# Altium schematic sheet 4-20mA_Converter.SchDoc: Access Control
size A3; DrawnBy: Q.Thang & T.Khoa; Revision: V1.0.1; SheetNumber: 13; SheetTotal: 16
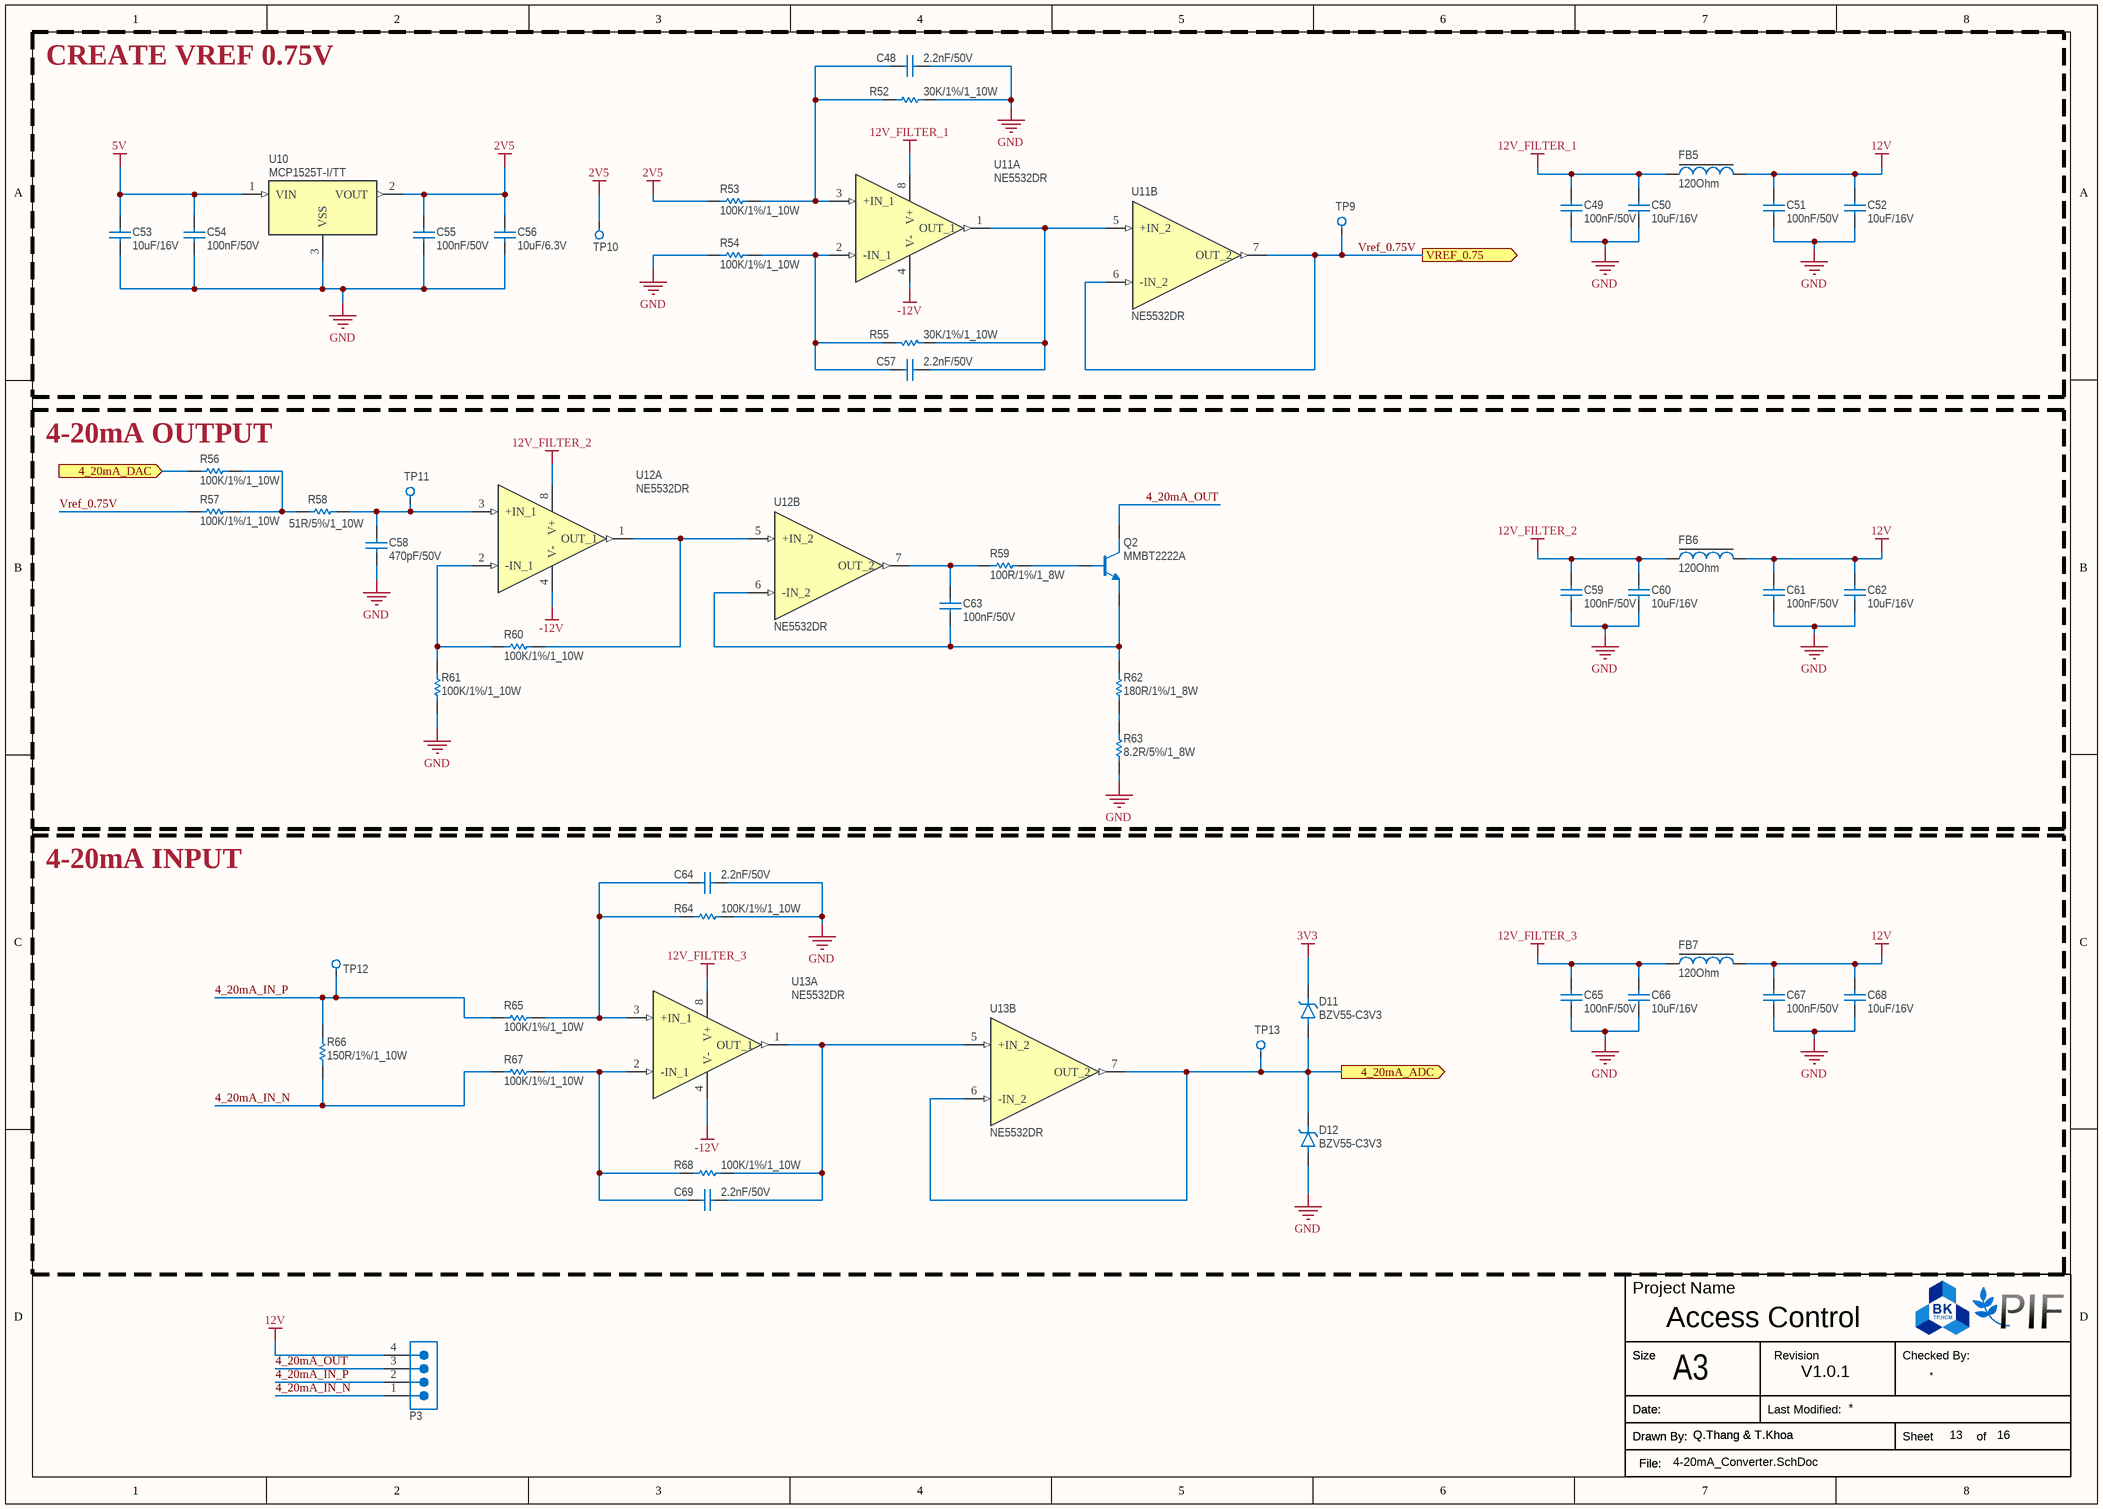
[diagram p0: 4-20mA_Converter.SchDoc]

## Parts
C48  2.2nF/50V  [CAP_0603]
C49  100nF/50V  [CAP_0603]
C50  10uF/16V  [CAP_0603]
C51  100nF/50V  [CAP_0603]
C52  10uF/16V  [CAP_0603]
C53  10uF/16V  [CAP_0603]
C54  100nF/50V  [CAP_0603]
C55  100nF/50V  [CAP_0603]
C56  10uF/6.3V  [CAP_0603]
C57  2.2nF/50V  [CAP_0603]
C58  470pF/50V  [CAP_0603]
C59  100nF/50V  [CAP_0603]
C60  10uF/16V  [CAP_0603]
C61  100nF/50V  [CAP_0603]
C62  10uF/16V  [CAP_0603]
C63  100nF/50V  [CAP_0603]
C64  2.2nF/50V  [CAP_0603]
C65  100nF/50V  [CAP_0603]
C66  10uF/16V  [CAP_0603]
C67  100nF/50V  [CAP_0603]
C68  10uF/16V  [CAP_0603]
C69  2.2nF/50V  [CAP_0603]
D11  BZV55-C3V3  [SOD-80]
D12  BZV55-C3V3  [SOD-80]
FB5  120Ohm  [Ferrite_Bead_0805]
FB6  120Ohm  [Ferrite_Bead_0805]
FB7  120Ohm  [Ferrite_Bead_0805]
P3  3.81mm_4P  [Terminal_Block_3.81mm_4P]  (value not drawn)
Q2  MMBT2222A  [SOT-23]
R52  30K/1%/1_10W  [Resistor_0603]
R53  100K/1%/1_10W  [Resistor_0603]
R54  100K/1%/1_10W  [Resistor_0603]
R55  30K/1%/1_10W  [Resistor_0603]
R56  100K/1%/1_10W  [Resistor_0603]
R57  100K/1%/1_10W  [Resistor_0603]
R58  51R/5%/1_10W  [Resistor_0603]
R59  100R/1%/1_8W  [Resistor_0603]
R60  100K/1%/1_10W  [Resistor_0603]
R61  100K/1%/1_10W  [Resistor_0603]
R62  180R/1%/1_8W  [Resistor_0805]
R63  8.2R/5%/1_8W  [Resistor_0805]
R64  100K/1%/1_10W  [Resistor_0603]
R65  100K/1%/1_10W  [Resistor_0603]
R66  150R/1%/1_10W  [Resistor_0603]
R67  100K/1%/1_10W  [Resistor_0603]
R68  100K/1%/1_10W  [Resistor_0603]
TP9  VREF_0.75V  [TestPoint_Pad_3.0x3.0mm]  (value not drawn)
TP10  2V5  [TestPoint_Pad_3.0x3.0mm]  (value not drawn)
TP11  4-20mA_DAC  [TestPoint_THTPad_D1.5mm_Drill0.7mm]  (value not drawn)
TP12  4_20mA_IN  [TestPoint_THTPad_D1.5mm_Drill0.7mm]  (value not drawn)
TP13  4-20mA_ADC  [TestPoint_THTPad_D1.5mm_Drill0.7mm]  (value not drawn)
U10  MCP1525T-I/TT  [SOT-23]
U11  NE5532DR  [SOIC-8]  (parts A,B of 2)
U12  NE5532DR  [SOIC-8]  (parts A,B of 2)
U13  NE5532DR  [SOIC-8]  (parts A,B of 2)

## Blocks framed on the sheet
CREATE VREF 0.75V: C48-C57 FB5 R52-R55 TP9 TP10 U10 U11
4-20mA OUTPUT: C58-C63 FB6 Q2 R56-R63 TP11 U12
4-20mA INPUT: C64-C69 D11 D12 FB7 R64-R68 TP12 TP13 U13

## Ports
4_20mA_ADC (out, see Overview_Schematic[6C], DAC_ADC_External[2B]), 4_20mA_DAC (in, see Overview_Schematic[6C], DAC_ADC_External[3C]), VREF_0.75 (out, see Overview_Schematic[6C], DAC_ADC_External[1B])

## Nets
2V5: C55.2 C56.2 R53.1 TP10.1 U10.2(VOUT)
3V3: D11.C
5V: C53.2 C54.2 U10.1(VIN)
12V: C51.2 C52.2 C61.2 C62.2 C67.2 C68.2 FB5.2 FB6.2 FB7.2 P3.4
12V_FILTER_1: C49.2 C50.2 FB5.1 U11.8(V+)
12V_FILTER_2: C59.2 C60.2 FB6.1 U12.8(V+)
12V_FILTER_3: C65.2 C66.2 FB7.1 U13.8(V+)
-12V: U11.4(V-) U12.4(V-) U13.4(V-)
GND: C48.2 C49.1 C50.1 C51.1 C52.1 C53.1 C54.1 C55.1 C56.1 C58.1 C59.1 C60.1 C61.1 C62.1 C64.2 C65.1 C66.1 C67.1 C68.1 D12.A R52.2 R54.1 R61.1 R63.2 R64.2 U10.3(VSS)
4_20mA_ADC: D11.A D12.C TP13.1 U13.6(-IN_2) U13.7(OUT_2) ; port 4_20mA_ADC
4_20mA_DAC: R56.1 ; port 4_20mA_DAC
4_20mA_IN_N: P3.1 R66.1 R67.1
4_20mA_IN_P: P3.2 R65.1 R66.2 TP12.1
4_20mA_OUT: P3.3 Q2.3(C)
Vref_0.75V: R57.1 TP9.1 U11.6(-IN_2) U11.7(OUT_2) ; port VREF_0.75
NetC48_1: C48.1 R52.1 R53.2 U11.3(+IN_1)
NetC57_1: C57.1 R54.2 R55.1 U11.2(-IN_1)
NetC57_2: C57.2 R55.2 U11.1(OUT_1) U11.5(+IN_2)
NetC58_2: C58.2 R58.2 TP11.1 U12.3(+IN_1)
NetC63_1: C63.1 Q2.2(E) R62.2 U12.6(-IN_2)
NetC63_2: C63.2 R59.1 U12.7(OUT_2)
NetC64_1: C64.1 R64.1 R65.2 U13.3(+IN_1)
NetC69_1: C69.1 R67.2 R68.1 U13.2(-IN_1)
NetC69_2: C69.2 R68.2 U13.1(OUT_1) U13.5(+IN_2)
NetQ2_1: Q2.1(B) R59.2
NetR56_2: R56.2 R57.2 R58.1
NetR60_1: R60.1 R61.2 U12.2(-IN_1)
NetR60_2: R60.2 U12.1(OUT_1) U12.5(+IN_2)
NetR62_1: R62.1 R63.1

## Notes on the sheet
- Project Name
- Size
- A3
- Revision
- Checked By:
- Drawn By:
- Date:
- File:
- Last Modified:
- Sheet
- of

## Library data of the parts
C48 C57 C64 C69 = Ceramic_Cap_2.2nF_50V_0603: CAP, size 0603, 2.2nF, 50V; Supply Part Number: CC0603KRX7R9BB222; Supply Name: tme; Datasheet: *; Supply URL: http://www.tme.vn/Product.aspx?id=1310#page=pro_info
C49 C51 C54 C55 C59 C61 C63 C65 C67 = Ceramic_Cap_100nF_50V_0603: CAP, size 0603, 100nF, 50V; Supply Part Number: Tụ Gốm 0603 100nF (0.1uF) 50V; Supply Name: Thegioiic; Datasheet: *; Supply URL: https://www.thegioiic.com/tu-gom-0603-100nf-0-1uf-50v
C50 C52 C53 C60 C62 C66 C68 = Ceramic_Cap_10uF_16V_0603: CAP, size 0603, 10uF, 16V; Supply Part Number: Tụ Gốm 0603 10uF 16V; Supply Name: Thegioiic; Datasheet: *; Supply URL: https://www.thegioiic.com/tu-gom-0603-10uf-16v
C56 = Ceramic_Cap_10uF_6.3V_0603: CAP, size 0603, 10uF, 6.3V; Supply Part Number: CC0603KRX5R5BB106; Supply Name: tme; Datasheet: *; Supply URL: http://www.tme.vn/Product.aspx?id=1165#page=pro_info
C58 = Ceramic_Cap_470pF_50V_0603: CAP, size 0603, 470pF, 50V; Supply Part Number: Tụ Gốm 0603 470pF 50V; Supply Name: Thegioiic; Datasheet: *; Supply URL: https://www.thegioiic.com/tu-gom-0603-470pf-50v
D11 D12 = Diode_BZV55C3V3: DIODE ZENER 3.3V 500 mW; Supply Name: tme; Datasheet: https://www.alldatasheet.com/datasheet-pdf/view/17578/PHILIPS/BZV55.html; Supply Part Number: BZV55-C3V3; Supply URL: http://www.tme.vn/Product.aspx?id=1871#page=pro_info
FB5-FB7 = Ferrite_Bead_120Ohm_2A_0805: Ferrite Bead, size 0805, 120Ohm, 2A; Supply Part Number: CBW201209U121T Ferrite Beads 2A 120 Ohm 0805; Supply Name: Thegioiic; Supply URL: https://www.thegioiic.com/cbw201209u121t-ferrite-beads-2a-120-ohm-0805
P3 = Terminal_Block_3.81mm_4P: Terminal Block THT, pitch 3.81mm, 4p, 300V 10A; Supply Part Number: UL-3.81-4-R Terminal Block Plug-in Hàn PCB 4 Chân Cong 3.81mm 300V 10A ULO; Supply Name: Thegioiic; ComponentLink1Description: Website Link; ComponentLink1URL: https://www.we-online.com/redexpert/article/691322310004?ad; ComponentLink2Description: Datasheet Link; ComponentLink2URL: https://www.we-online.com/redexpert/spec/691322310004?ad; Supply URL: https://www.thegioiic.com/ul-3-81-4-r-terminal-block-plug-in-han-pcb-4-chan-cong-3-81mm-300v-10a-ulo
Q2 = MMBT2222A: Điện áp Vce max: 40V, dòng Ic max: 0.6A, công suất: 0.3W; Supply Part Number: MMBT2222A 1P Transistor NPN 40V 0.6A 3 Chân SOT-23; Supply Name: Thegioiic; Datasheet: https://www.thegioiic.com/upload/documents/1734592311_MMBT2222A.pdf; Supply URL: https://www.thegioiic.com/mmbt2222a-1p-transistor-npn-40v-0-6a-3-chan-sot-23
R52 R55 = Res_30K_0603_1%: Resistor 0603 30KOhm 1% 1_10W; Supply Part Number: Điện Trở 30 KOhm 0603 1%; Supply Name: LinhkienX; Supply URL: https://linhkienx.com/vi/dien-tro-30-kohm-0603-1-
R53 R54 R56 R57 R60 R61 R64 R65 R67 R68 = Res_100K_0603_1%: Resistor 0603 100KOhm 1% 1_10W; Supply Part Number: Điện Trở 100 KOhm 0603 1%; Supply Name: Thegioiic; Supply URL: https://www.thegioiic.com/dien-tro-100-kohm-0603-1-
R58 = Res_51R_0603_5%: Resistor 0603 51 Ohm 5% 1_10W; Supply Part Number: Điện Trở 51 Ohm 0603 5%; Supply Name: Thegioiic; Supply URL: https://www.thegioiic.com/dien-tro-51-ohm-0603-5-
R59 = Res_100R_0805_1%: Resistor 0805 100 Ohm 1% 1_8W; Supply Part Number: Điện Trở 100 Ohm 0805 1%; Supply Name: Thegioiic; Supply URL: https://www.thegioiic.com/dien-tro-100-ohm-0805-1-
R62 = Res_180R_0805_1%: Resistor 0805 180 Ohm 1% 1_8W; Supply Part Number: Điện Trở 180 Ohm 0805 1%; Supply Name: Thegioiic; Supply URL: https://www.thegioiic.com/dien-tro-180-ohm-0805-1-
R63 = Res_8.2R_0805_5%: Resistor 0805 8.2 Ohm 5% 1_8W; Supply Part Number: Điện Trở 8.2 Ohm 0805 5%; Supply Name: Thegioiic; Supply URL: https://www.thegioiic.com/dien-tro-8-2-ohm-0805-5-
R66 = Res_150R_0603_1%: Resistor 0603 150 Ohm 1% 1_10W; Supply Part Number: Điện Trở 150 Ohm 0603 1%; Supply Name: Thegioiic; Supply URL: https://www.thegioiic.com/dien-tro-150-ohm-0603-1-
TP9 TP10 = Testpoint_SMD: Datasheet: *; Supply Name: *; Supply Part Number: *; Supply URL: *
TP11-TP13 = Testpoint_TH: Test Point TEST-1BK; Supply Name: BanLinhKien; Datasheet: *; Supply Part Number: Test Point TEST-1BK; Supply URL: https://banlinhkien.com/test-point-test1bk-mau-den-5c-p18255999.html
U10 = MCP1525T-I/TT: Voltage Reference IC 2.5V; Supply Part Number: MCP1525T-I/TT IC Tham Chiếu Điện Áp 2.5V SOT-23; Supply Name: Thegioiic; Datasheet: https://ww1.microchip.com/downloads/aemDocuments/documents/APID/ProductDocuments/DataSheets/21653C.pdf; Supply URL: https://www.thegioiic.com/mcp1525t-i-tt-ic-tham-chieu-dien-ap-2-5v-sot-23
U11-U13 = NE5532DR: Low Noise Single/Dual Operational Amplifier - SOIC-8; Supply Name: tme; Datasheet: https://www.ti.com/lit/ds/symlink/ne5532.pdf; Supply Part Number: NE5532DR; Supply URL: http://www.tme.vn/Product.aspx?id=2122#page=pro_info